# EAGLE design 4024_bin_counter (EAGLE 8.0.0)

## Sheet 1 of 2
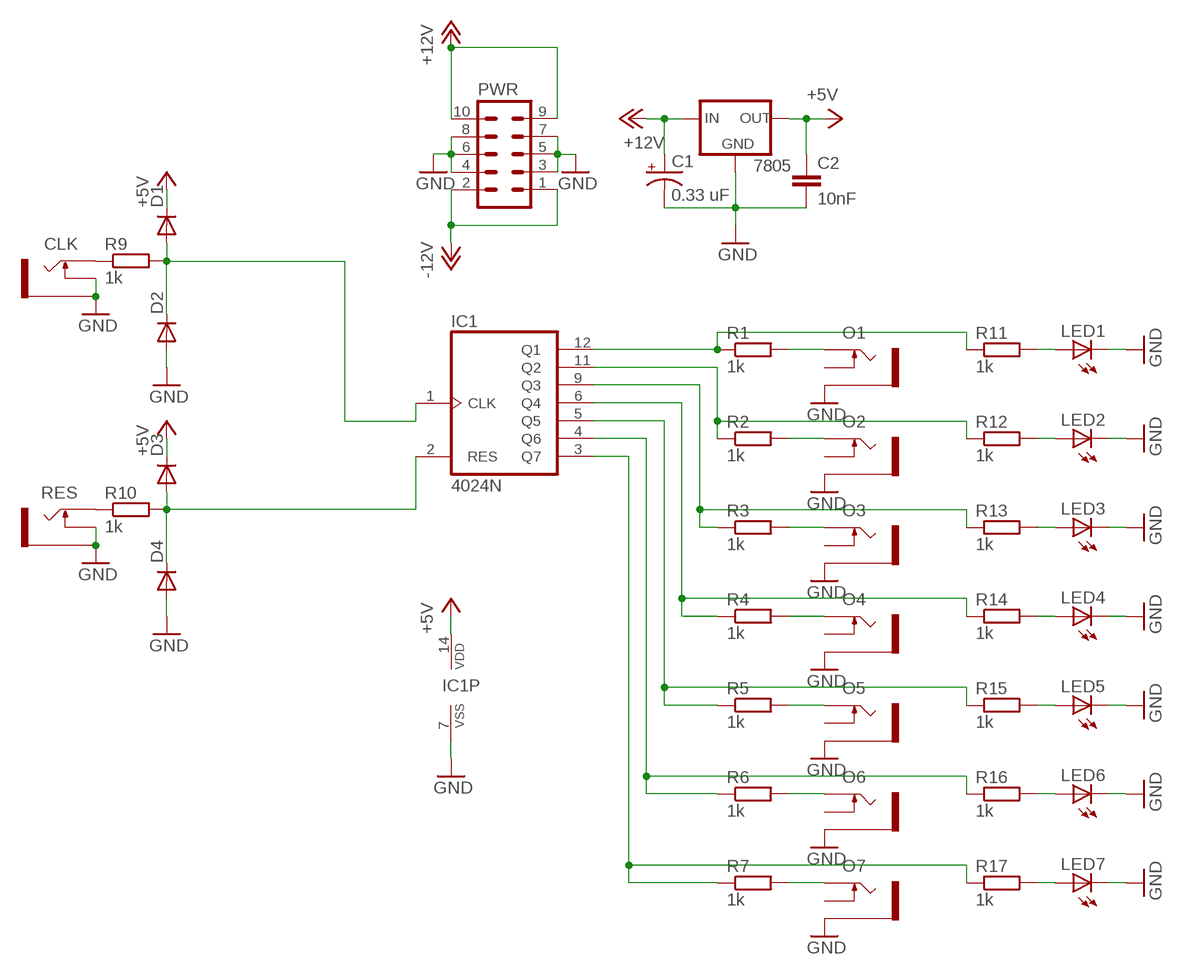
[diagram p0: schematic, sheet 1]

### Parts
7805  78XXS  [78XXS]
C1  0.33 uF  CPOL-USE2.5-7  [E2,5-7]
C2  10nF  10NF-PTH-10MM-10000V-1-%  [CAP-PTH-10MM]
CLK  THONKICONNNEW  [WQP-PJ301M-12_JACK]
D1  SMALL_DIODEDO35-7  [DO35-7]
D2  SMALL_DIODEDO35-7  [DO35-7]
D3  SMALL_DIODEDO35-7  [DO35-7]
D4  SMALL_DIODEDO35-7  [DO35-7]
IC1  4024N  [DIL14]
LED1  LED3MM  [LED3MM]
LED2  LED3MM  [LED3MM]
LED3  LED3MM  [LED3MM]
LED4  LED3MM  [LED3MM]
LED5  LED3MM  [LED3MM]
LED6  LED3MM  [LED3MM]
LED7  LED3MM  [LED3MM]
O1  THONKICONNNEW  [WQP-PJ301M-12_JACK]
O2  THONKICONNNEW  [WQP-PJ301M-12_JACK]
O3  THONKICONNNEW  [WQP-PJ301M-12_JACK]
O4  THONKICONNNEW  [WQP-PJ301M-12_JACK]
O5  THONKICONNNEW  [WQP-PJ301M-12_JACK]
O6  THONKICONNNEW  [WQP-PJ301M-12_JACK]
O7  THONKICONNNEW  [WQP-PJ301M-12_JACK]
PWR  EURO_POWER_HEADERFAT_PADS  [EURO_PWR_HEADER_FAT]
R1  1k  RESISTOR7MM  [7MM_RESISTOR]
R2  1k  RESISTOR7MM  [7MM_RESISTOR]
R3  1k  RESISTOR7MM  [7MM_RESISTOR]
R4  1k  RESISTOR7MM  [7MM_RESISTOR]
R5  1k  RESISTOR7MM  [7MM_RESISTOR]
R6  1k  RESISTOR7MM  [7MM_RESISTOR]
R7  1k  RESISTOR7MM  [7MM_RESISTOR]
R9  1k  RESISTOR7MM  [7MM_RESISTOR]
R10  1k  RESISTOR7MM  [7MM_RESISTOR]
R11  1k  RESISTOR7MM  [7MM_RESISTOR]
R12  1k  RESISTOR7MM  [7MM_RESISTOR]
R13  1k  RESISTOR7MM  [7MM_RESISTOR]
R14  1k  RESISTOR7MM  [7MM_RESISTOR]
R15  1k  RESISTOR7MM  [7MM_RESISTOR]
R16  1k  RESISTOR7MM  [7MM_RESISTOR]
R17  1k  RESISTOR7MM  [7MM_RESISTOR]
RES  THONKICONNNEW  [WQP-PJ301M-12_JACK]

### Nets
+5V: 7805.OUT C2.1 D1.C D3.C IC1.14(VDD)
+12V: 7805.IN C1.+ PWR.9 PWR.10
-12V: PWR.1 PWR.2
GND: 7805.GND C1.- C2.2 CLK.P$2_SWITCH(SWITCH) CLK.P$3_SLEEVE(SLEEVE) D2.A D4.A IC1.7(VSS) LED1.K(C) LED2.K(C) LED3.K(C) LED4.K(C) LED5.K(C) LED6.K(C) LED7.K(C) O1.P$3_SLEEVE(SLEEVE) O2.P$3_SLEEVE(SLEEVE) O3.P$3_SLEEVE(SLEEVE) O4.P$3_SLEEVE(SLEEVE) O5.P$3_SLEEVE(SLEEVE) O6.P$3_SLEEVE(SLEEVE) O7.P$3_SLEEVE(SLEEVE) PWR.3 PWR.4 PWR.5 PWR.6 PWR.7 PWR.8 RES.P$2_SWITCH(SWITCH) RES.P$3_SLEEVE(SLEEVE)
N$1: CLK.P$1_TIP(TIP) R9.1
N$2: R10.1 RES.P$1_TIP(TIP)
N$3: IC1.11(Q2) R2.1 R12.1
N$4: IC1.9(Q3) R3.1 R13.1
N$5: IC1.6(Q4) R4.1 R14.1
N$6: IC1.5(Q5) R5.1 R15.1
N$8: O1.P$1_TIP(TIP) R1.2
N$9: O2.P$1_TIP(TIP) R2.2
N$10: O3.P$1_TIP(TIP) R3.2
N$19: D1.A D2.C IC1.1(CLK) R9.2
N$20: IC1.12(Q1) R1.1 R11.1
N$21: D3.A D4.C IC1.2(RES) R10.2
N$22: LED1.A R11.2
N$23: O4.P$1_TIP(TIP) R4.2
N$24: LED2.A R12.2
N$25: O5.P$1_TIP(TIP) R5.2
N$26: LED3.A R13.2
N$27: O6.P$1_TIP(TIP) R6.2
N$28: LED4.A R14.2
N$29: O7.P$1_TIP(TIP) R7.2
N$30: LED5.A R15.2
N$31: IC1.4(Q6) R6.1 R16.1
N$32: LED6.A R16.2
N$33: IC1.3(Q7) R7.1 R17.1
N$34: LED7.A R17.2
Unconnected: O1.P$2_SWITCH(SWITCH) O2.P$2_SWITCH(SWITCH) O3.P$2_SWITCH(SWITCH) O4.P$2_SWITCH(SWITCH) O5.P$2_SWITCH(SWITCH) O6.P$2_SWITCH(SWITCH) O7.P$2_SWITCH(SWITCH)

## Sheet 2 of 2

## Library data of the parts
7805 = v-reg:78XXS: VOLTAGE REGULATOR
C1 = rcl:CPOL-US: POLARIZED CAPACITOR, American symbol
C2 = SparkFun-Capacitors:10NF: 0.01uF/10nF/10,000pF ceramic capacitors A capacitor is a passive two-terminal electrical component used to store electrical energy temporarily in an electric field. CAP-09321; PROD_ID: CAP-09321
CLK O1-O7 RES = MusicThingModular:THONKICONN: 3.5mm socket for Eurorack modular synths
D1-D4 = MusicThingModular:SMALL_DIODE: Small Signal Diode
IC1 = 40xx:4024: 7-stage binary/ripple COUNTER
LED1-LED7 = led:LED: LED OSRAM: - CHIPLED LG R971, LG N971, LY N971, LG Q971, LY Q971, LO R971, LY R971 LH N974, LH R974 LS Q976, LO Q976, LY Q976 LO Q996 - Hyper CHIPLED LW Q18S LB Q993, LB Q99A, LB R99A - SideLED LS A670, LO A670, LY A670, LG A670, LP A670 LB A673, LV A673, LT A673, LW A673 LH A674 LY A675 LS A676, LA A676, LO A676, LY A676, LW A676 LS A679, LY A679, LG A679 - Hyper Micro SIDELED® LS Y876, LA Y876, LO Y876, LY Y876 LT Y87S - SmartLED LW L88C, LW L88S LB L89C, LB L89S, LG L890 LS L89K, LO L89K, LY L89K LS L896, LA L896, LO L896, LY L896 - TOPLED LS T670, LO T670, LY T670, LG T670, LP T670 LSG T670, LSP T670, LSY T670, LOP T670, LYG T670 LG T671, LOG T671, LSG T671 LB T673, LV T673, LT T673, LW T673 LH T674 LS T676, LA T676, LO T676, LY T676, LB T676, LH T676, LSB T676, LW T676 LB T67C, LV T67C, LT T67C, LS T67K, LO T67K, LY T67K, LW E67C LS E67B, LA E67B, LO E67B, LY E67B, LB E67C, LV E67C, LT E67C LW T67C LS T679, LY T679, LG T679 LS T770, LO T770, LY T770, LG T770, LP T770 LB T773, LV T773, LT T773, LW T773 LH T774 LS E675, LA E675, LY E675, LS T675 LS T776, LA T776, LO T776, LY T776, LB T776 LHGB T686 LT T68C, LB T68C - Hyper Mini TOPLED® LB M676 - Mini TOPLED Santana® LG M470 LS M47K, LO M47K, LY M47K Source: http://www.osram.convergy.de LUXEON: - LUMILED® LXK2-PW12-R00, LXK2-PW12-S00, LXK2-PW14-U00, LXK2-PW14-V00 LXK2-PM12-R00, LXK2-PM12-S00, LXK2-PM14-U00 LXK2-PE12-Q00, LXK2-PE12-R00, LXK2-PE12-S00, LXK2-PE14-T00, LXK2-PE14-U00 LXK2-PB12-K00, LXK2-PB12-L00, LXK2-PB12-M00, LXK2-PB14-N00, LXK2-PB14-P00, LXK2-PB14-Q00 LXK2-PR12-L00, LXK2-PR12-M00, LXK2-PR14-Q00, LXK2-PR14-R00 LXK2-PD12-Q00, LXK2-PD12-R00, LXK2-PD12-S00 LXK2-PH12-R00, LXK2-PH12-S00 LXK2-PL12-P00, LXK2-PL12-Q00, LXK2-PL12-R00 Source: www.luxeon.com KINGBRIGHT: KA-3528ASYC Source: www.kingbright.com
PWR = MusicThingModular:EURO_POWER_HEADER: Power Header 10 pin power header for Eurorack Power Supplies Variants with fatter pads for easier soldering, and the LOCK variant which has 5mil offset pins to hold the component in place before soldering
R1-R7 R9-R17 = MusicThingModular:RESISTOR: Standard resistor, various versions

## Board
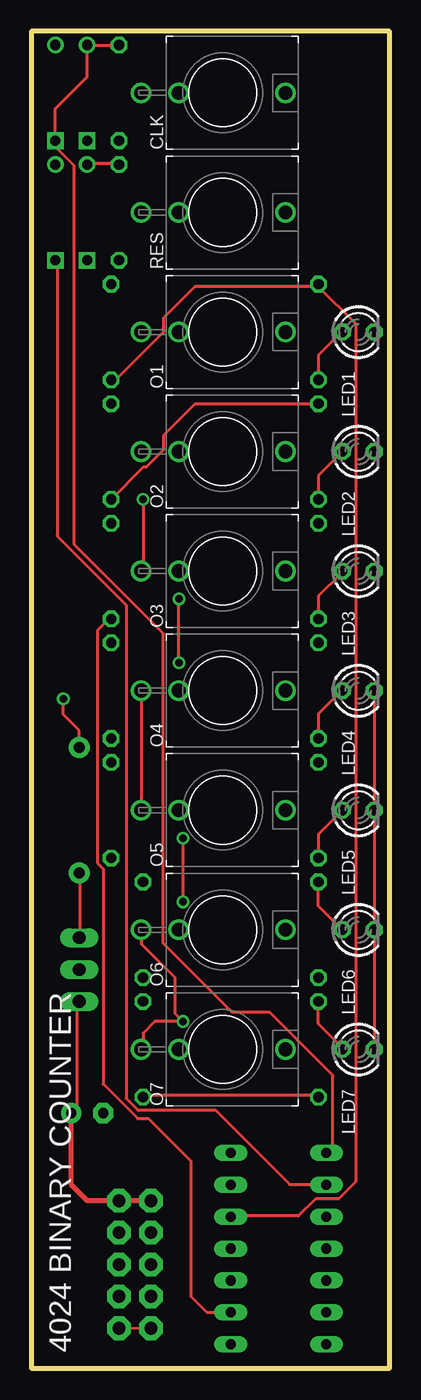
[diagram p1: board, top side]
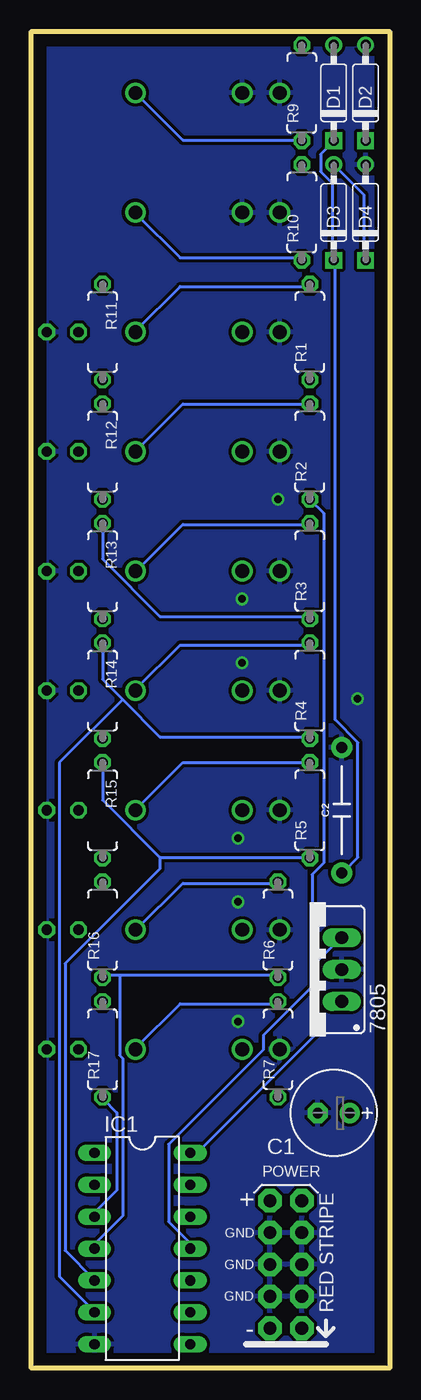
[diagram p2: board, bottom side, seen from below]

Size 28.52 x 106.5 mm. Coordinates in mm from the lower left corner, seen from the top.
Outline: 0,100 0,0
Outline: 0,0 28.52,0 28.52,106.5 0,106.5 0,0
Copper layers (1*16): Top 0.035mm / dielectric 1.5mm / Bottom 0.035mm
Design rules "default": minimum track width 10mil, minimum drill 24mil, track to track 8mil, track to pad 8mil, pad to pad 8mil, via to via 8mil, smd to smd 8mil, copper to edge 40mil, drill to drill 8mil, minimum pad ring 10mil, minimum via ring 8mil, stop-mask expansion 4mil, vias tented up to drill 0mil, thermal gap 10mil

### Footprints (pad centres in the part's own frame; a part is rotated, then mirrored left to right if it is on the bottom)
78XXS = drill 1.016 long: GND 0,-2.54; IN -2.54,-2.54; OUT 2.54,-2.54
E2,5-7 = drill 0.813 pad 1.6: + -1.27,0 | drill 0.813 pad 1.6 octagon: - 1.27,0
CAP-PTH-10MM = drill 0.9 pad 1.651: 1 -5,0; 2 5,0
WQP-PJ301M-12_JACK = drill 1.1: P$1_TIP 0,5; P$2_SWITCH 0,-3.5; P$3_SLEEVE 0,-6.5
DO35-7 = drill 0.813: A 3.81,0 | drill 0.813 square: C -3.81,0
DIL14 = drill 0.813 long: 1 -7.62,-3.81; 2 -5.08,-3.81; 3 -2.54,-3.81; 4 0,-3.81; 5 2.54,-3.81; 6 5.08,-3.81; 7 7.62,-3.81; 8 7.62,3.81; 9 5.08,3.81; 10 2.54,3.81; 11 0,3.81; 12 -2.54,3.81; 13 -5.08,3.81; 14 -7.62,3.81
LED3MM = drill 0.813 octagon: A -1.27,0; K 1.27,0
EURO_PWR_HEADER_FAT = drill 1.016 pad 1.88 octagon: 1 -5.08,-1.27; 2 -5.08,1.27; 3 -2.54,-1.27; 4 -2.54,1.27; 5 0,-1.27; 6 0,1.27; 7 2.54,-1.27; 8 2.54,1.27; 9 5.08,-1.27; 10 5.08,1.27
7MM_RESISTOR = drill 0.813 octagon: 1 -3.81,0; 2 3.81,0

### Placement (x,y rotation side)
7805  6.35,31.75 90 bottom
C1  4.45,20.32 180 bottom
C2  3.81,44.45 90 bottom
CLK  15.24,101.6 270 top
D1  4.45,101.6 90 bottom
D2  1.91,101.6 90 bottom
D3  4.45,92.08 90 bottom
D4  1.91,92.08 90 bottom
IC1  19.68,9.53 270 bottom
LED1  26.04,82.55 0 top
LED2  26.04,73.03 0 top
LED3  26.04,63.5 0 top
LED4  26.04,53.98 0 top
LED5  26.04,44.45 0 top
LED6  26.04,34.92 0 top
LED7  26.04,25.4 0 top
O1  15.24,82.55 270 top
O2  15.24,73.03 270 top
O3  15.24,63.5 270 top
O4  15.24,53.98 270 top
O5  15.24,44.45 270 top
O6  15.24,34.92 270 top
O7  15.24,25.4 270 top
PWR  8.26,8.26 90 bottom
R1  6.35,82.55 90 bottom
R2  6.35,73.03 90 bottom
R3  6.35,63.5 90 bottom
R4  6.35,53.98 90 bottom
R5  6.35,44.45 90 bottom
R6  8.89,34.92 90 bottom
R7  8.89,25.4 90 bottom
R9  6.99,101.6 90 bottom
R10  6.99,92.08 90 bottom
R11  22.86,82.55 270 bottom
R12  22.86,73.03 270 bottom
R13  22.86,63.5 270 bottom
R14  22.86,53.98 270 bottom
R15  22.86,44.45 270 bottom
R16  22.86,34.92 90 bottom
R17  22.86,25.4 90 bottom
RES  15.24,92.08 270 top

### Tracks (layer width: path | path; a pad name or v marks a point on that pad's centre or on a via)
+5V
  Top 0.254: C2.1 3.89,39.32 3.89,34.29 7805.OUT
  Bottom 0.254: D1.C 4.57,97.61 5.49,96.7 5.49,95.33 4.57,94.41 4.57,88.47 D3.C 4.34,88.24 4.34,51.66 2.52,49.84 2.52,40.69 3.66,39.55 C2.1 | IC1.14 15.32,17.14 5.71,26.75 5.71,32.46 3.89,34.29 7805.OUT
+12V
  Top 0.254: C1.+ 3.66,20.8 3.66,29.03 7805.IN
  Top 0.406: PWR.10 PWR.9 4.45,13.34 3.17,14.61 C1.+
-12V
  Top 0.254: PWR.1 7.11,3.2 6.86,3.2 PWR.2
GND  (via drill 0.6)
  Top 0.254: LED4.K LED5.K LED6.K LED7.K | O4.P$3_SLEEVE O5.P$3_SLEEVE | v12.06,42.23 v12.06,37.15 | O7.P$3_SLEEVE 8.89,25.55 8.89,26.67 9.84,27.62 v12.06,27.62 11.43,28.26 11.43,31.11 8.74,33.8 O6.P$3_SLEEVE | v8.89,69.22 8.89,63.65 O3.P$3_SLEEVE | v11.75,56.2 v11.75,61.28 | C2.2 3.81,50.8 2.54,52.07 v2.54,53.34
  pour Bottom (isolate 0.254): -0.64,107.95 30.48,107.95 30.48,-1.27 -0.64,-1.27
N$1
  Bottom 0.254: R9.1 7.09,97.84 16.46,97.84 20.12,101.5 CLK.P$1_TIP
N$2
  Bottom 0.254: R10.1 7.09,88.47 16.69,88.47 20.12,91.9 RES.P$1_TIP
N$3
  Top 0.254: R2.1 8.91,71.78 9.14,71.78 10.52,73.15 10.52,74.3 13.03,76.81 22.86,76.81 R12.1
  Bottom 0.254: R2.1 5.26,68.12 5.26,40.23 6.17,39.32 6.17,30.4 10.06,26.52 10.06,25.38 17.6,17.83 17.6,11.66 16,10.06 16,9.6 IC1.11
N$4
  Top 0.254: 15.77,4.57 IC1.9 13.97,4.45 12.7,5.71 12.7,16.51 9.32,19.89 8.46,19.89 5.71,22.63 5.71,39.78 5.26,40.23 5.26,58.75 6.17,59.66 R3.1
  Bottom 0.254: R13.1 22.86,64.47 18.29,59.89 6.4,59.89 R3.1
N$5
  Bottom 0.254: 21.26,53.26 22.86,54.86 R14.1 | 21.26,53.26 18.29,50.29 6.4,50.29 R4.1 | 21.26,53.26 26.29,48.23 26.29,7.32 23.55,4.57 IC1.6
N$6
  Bottom 0.254: 18.29,40.69 6.4,40.69 R5.1 | 18.29,40.69 22.86,45.26 R15.1 | 18.29,40.69 18.29,39.78 25.83,32.23 25.83,9.37 23.55,7.09 IC1.5
N$8
  Bottom 0.254: R1.2 6.4,86.18 16.69,86.18 20.12,82.75 O1.P$1_TIP
N$9
  Bottom 0.254: R2.2 6.4,76.81 16.46,76.81 20.12,73.15 O2.P$1_TIP
N$10
  Bottom 0.254: R3.2 6.4,67.21 16.46,67.21 20.12,63.55 O3.P$1_TIP
N$19
  Top 0.254: IC1.1 23.55,17.14 24,17.6 24,23.32 18.97,28.35 16,28.35 10.52,33.83 10.52,58.52 3.43,65.61 3.43,95.78 2.06,97.16 2.06,97.61 D2.C 1.91,100.33 4.45,102.87 D1.A R9.2
N$20
  Top 0.254: 22.86,86.18 13.03,86.18 10.52,83.67 10.52,82.53 6.86,78.87 6.4,78.87 R1.1 | 22.86,86.18 25.83,83.21 25.83,14.86 24.46,13.49 22.63,13.49 21.26,12.12 16,12.12 IC1.12 | 22.86,86.18 R11.1
N$21
  Top 0.254: R10.2 6.86,96.01 4.57,96.01 D3.A | IC1.2 23.32,14.63 20.57,14.63 14.63,20.57 8.46,20.57 7.54,21.49 7.54,60.81 2.06,66.29 2.06,88.24 D4.C
  Bottom 0.254: D3.A 2.06,93.5 2.06,88.47 D4.C
N$22
  Top 0.254: R11.2 22.86,80.7 24.69,82.53 LED1.A
N$23
  Bottom 0.254: R4.2 6.4,57.61 16.69,57.61 20.12,54.18 O4.P$1_TIP
N$24
  Top 0.254: R12.2 22.86,71.09 24.69,72.92 LED2.A
N$25
  Bottom 0.254: R5.2 6.4,48.23 16.46,48.23 20.12,44.58 O5.P$1_TIP
N$26
  Top 0.254: R13.2 22.86,61.49 24.69,63.32 LED3.A
N$27
  Bottom 0.254: R6.2 8.91,38.63 16.46,38.63 20.12,34.98 O6.P$1_TIP
N$28
  Top 0.254: R14.2 22.86,52.12 24.69,53.95 LED4.A
N$29
  Bottom 0.254: R7.2 8.91,29.03 16.69,29.03 20.12,25.6 O7.P$1_TIP
N$30
  Top 0.254: R15.2 22.86,42.52 24.69,44.35 LED5.A
N$31
  Bottom 0.254: 21.49,31.32 22.86,31.32 R16.1 | 21.49,31.32 8.91,31.32 R6.1 | 21.49,31.32 21.49,24.92 21.26,24.69 21.26,12.12 23.32,10.06 23.32,9.6 IC1.4
N$32
  Top 0.254: R16.2 22.86,36.8 24.69,34.98 LED6.A
N$33
  Top 0.254: R7.1 8.91,21.72 22.86,21.72 R17.1
  Bottom 0.254: IC1.3 23.32,12.12 23.32,12.57 21.72,14.17 21.72,20.34 22.86,21.49 R17.1
N$34
  Top 0.254: R17.2 22.86,27.43 24.69,25.6 LED7.A

### Text on the board
tNames: 4024 BINARY COUNTER